# Altium schematic sheet 3V3_Smooth.SchDoc
size 193 x 146 mm; SheetNumber: 25; SheetTotal: 29
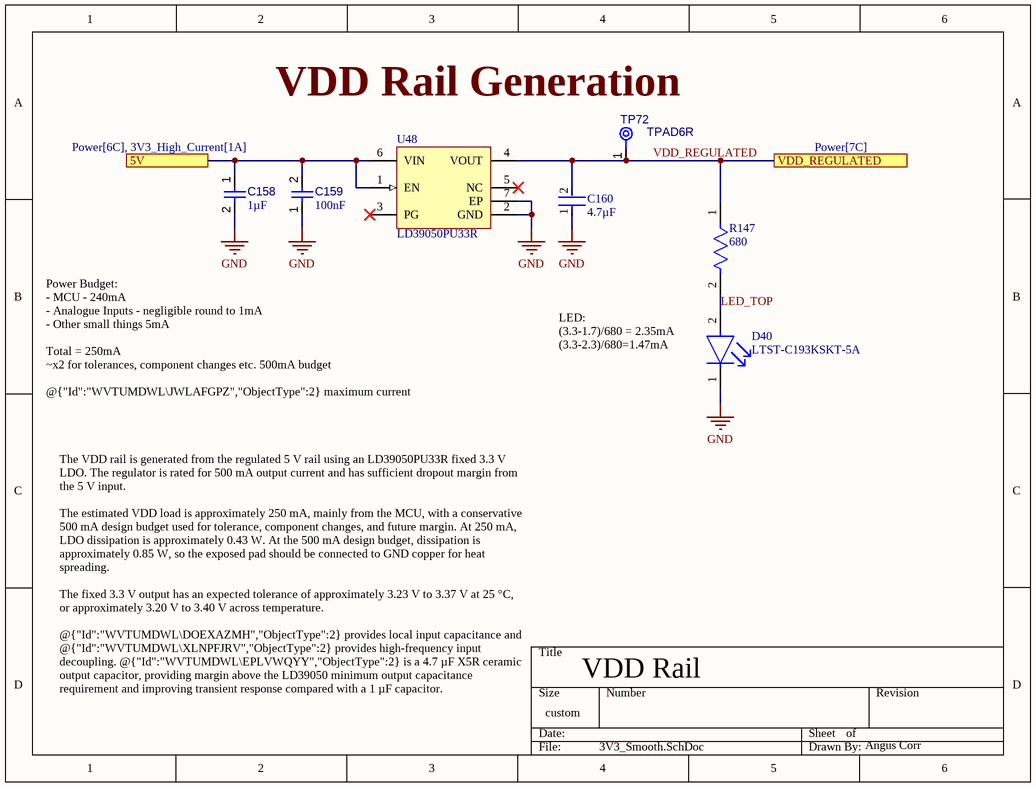
[diagram p0: 3V3_Smooth.SchDoc]

## Parts
C158  value 1µF  [CAPC1608X90X40LL10T20]  (hidden comment: Capacitor 1 uF +/- 10% 25 V 0603)
C159  value 100nF  [CAPC1608X90X40NL10T20]  (hidden comment: Capacitor 100 nF +/-10% 50 V 0603)
C160  value 4.7µF  [FP-GRM21B-0_2-e0_2_0_7-MFG]  (hidden comment: GRM21BZ71H475KE15L)
D40  LTST-C193KSKT-5A  [FP-LTST-C193KGKT-5A-MFG]
R147  value 680  [FP-CRCW0603-e3-IPC_C]  (hidden comment: CRCW0603680RJNEA)
TP72  TPAD6R  [TP06R]  (no BOM)
U48  LD39050PU33R  [DFN6D_L]

## Ports
5V (see Power[6C], 3V3_High_Current[1A]), VDD_REGULATED (see Power[7C])

## Nets
GND: C158.2 C159.1 C160.1 D40.1(C) U48.2(GND) U48.7(EP)
5V: C158.1 C159.2 U48.1(EN) U48.6(VIN) ; port 5V
LED_TOP: D40.2(A) R147.2
VDD_REGULATED: C160.2 R147.1 TP72.1(TP) U48.4(VOUT) ; port VDD_REGULATED

Not connected (* = marked no-connect by the designer): U48 3(PG)* 5(NC)*

## Notes on the sheet
- VDD Rail Generation
- Power Budget:
  - MCU - 240mA
  - Analogue Inputs - negligible round to 1mA
  - Other small things 5mA
  Total = 250mA
  ~x2 for tolerances, component changes etc. 500mA budget
  @{"Id":"WVTUMDWL\JWLAFGPZ","ObjectType":2} maximum current output of 500mA
- LED:
  (3.3-1.7)/680 = 2.35mA
  (3.3-2.3)/680=1.47mA
- The VDD rail is generated from the regulated 5 V rail using an LD39050PU33R fixed 3.3 V LDO. The regulator is rated for 500 mA output current and has sufficient dropout margin from the 5 V input.
  The estimated VDD load is approximately 250 mA, mainly from the MCU, with a conservative 500 mA design budget used for tolerance, component changes, and future margin. At 250 mA, LDO dissipation is approximately 0.43 W. At the 500 mA design budget, dissipation is approximately 0.85 W, so the exposed pad should be connected to GND copper for heat spreading.
  The fixed 3.3 V output has an expected tolerance of approximately 3.23 V to 3.37 V at 25 °C, or approximately 3.20 V to 3.40 V across temperature.
  @{"Id":"WVTUMDWL\DOEXAZMH","ObjectType":2} provides local input capacitance and @{"Id":"WVTUMDWL\XLNPFJRV","ObjectType":2} provides high-frequency input decoupling. @{"Id":"WVTUMDWL\EPLVWQYY","ObjectType":2} is a 4.7 µF X5R ceramic output capacitor, providing margin above the LD39050 minimum output capacitance requirement and improving transient response compared with a 1 µF capacitor.
  This rail is intended for internal VDD loads only, not as an external 3.3 V supply.
- VDD Rail
- Angus Corr

## Library data of the parts
C158 = CMP-001-00005-6: Chip Capacitor, 1 uF, +/- 10%, 25 V, 0603 (1608 Metric); Capacitor Type: Ceramic; Voltage Rating: 25V; Pins: 2; Mounting Technology: SM; RoHS Compliant: True; Max Operating Temperature: 125°C; Case/Package: 0603; Min Operating Temperature: -55°C; Tolerance: 10%
C159 = CMP-001-00017-6: Chip Capacitor, 100 nF, +/- 10%, 50 V, 0603 (1608 Metric); Voltage Rating: 50V; Capacitor Type: Ceramic; Tolerance: 10%; Mounting Technology: SM; Max Operating Temperature: 125°C; RoHS Compliant: True; Pins: 2; Case/Package: 0603; Min Operating Temperature: -55°C
C160 = CMP-001-00149-1: 50V 4.7uF X7R ±10% 0805 Multilayer Ceramic Capacitors MLCC - SMD/SMT ROHS; Manufacturer Lifecycle Status: IN PRODUCTION; Mounting Technology: Surface Mount; Case/Package: 0805; Min Operating Temperature: -55°C; Tolerance: 10%; Max Operating Temperature: 125°C; Voltage Rating: 50V; Country of Origin: Japan, Mainland China, Philippines, Singapore, Thailand; Dielectric Material: Ceramic; Export Control Classification Number (ECCN) Code: EAR99; Harmonized Tariff Schedule (HTS) Code: 8532.24.00.20; Height: 1.25mm; Introduction Date: 2017-02-22; Length: 2mm; Lifecycle Status: Production; Material: Ceramic; Number of Terminals: 2; REACH SVHC: Yes; RoHS: Compliant; Thickness: 1.25mm; Voltage Rating (DC): 50V; Width: 1.25mm
D40 = CMP-007-00044-1: LED yellow 0603 wavelength 587~594.5nm light intensity 7.1~45mcd Front Mounting; Shape: Rectangular; Power Dissipation: 50mW; Peak Wavelength: 591nm; Number of Circuits: 1; Lens Style: Colorless, Diffused, Rectangular; Test Current: 5mA; Forward Voltage: 2.3V; Lens Transparency: Clear; Lens Color: Clear, Colorless; Viewing Angle: 130°; Forward Current: 30mA; Reverse Voltage: 5V; Luminous Intensity: 26.05mcd; Schedule B: 8541402000, 8541402000; Introduction Date: 2007-04-09; Min Operating Temperature: -55°C; RoHS: Compliant; Terminal Pitch: 1.5mm; Case/Package: 0603; Width: 800µm; Dominant Wavelength: 594.5nm; Pins: 2; Case Code (Imperial): 0603; Height: 350µm; Length: 1.6mm; Color: Yellow; Lead Free: Lead Free; Max Operating Temperature: 85°C; Wavelength: 594.5nm; Harmonized Tariff Schedule (HTS) Code: 8541.40.20.00; China RoHS: Compliant; Illumination Color: Yellow; Number of Terminals: 2; Radiation Hardening: No; Case Code (Metric): 1608; Number of LEDs: 1; Depth: 800µm; Lifecycle Status: Production; REACH SVHC: Yes; Mounting Technology: Surface Mount; Number of Elements: 1
R147 = CMP-009-00300-1: Fixed Resistor, Metal Glaze/Thick Film, 0.1W, 680ohm, 75V, 5% +/-Tol, Surface Mount, 0603; Power Rating: 100mW; Temperature Coefficient: 200ppm/°C; Case/Package: 0603; Voltage Rating (DC): 75V; Lifecycle Status: Production; Depth: 850µm; Introduction Date: 2005-02-16; Number of Terminations: 2; Composition: Thick Film; Export Control Classification Number (ECCN) Code: EAR99; RoHS: Compliant; Packaging: Cut Tape; Max Power Dissipation: 100mW; Max Operating Temperature: 155°C; Harmonized Tariff Schedule (HTS) Code: 8533.21.00.30; Voltage Rating: 75V; China RoHS: Non-Compliant; Width: 850µm; Height: 450µm; Schedule B: 8533210045, 8533210045; Mounting Technology: Surface Mount; Pins: 2; Radiation Hardening: No; Features: Automotive AEC-Q200; Min Operating Temperature: -55°C; Lead Free: Lead Free; Working Voltage: 75V; Military Standard: Not; Tolerance: 5%; Case Code (Imperial): 0603; Number of Terminals: 2; Weight: 2.012816mg; REACH SVHC: Yes; Length: 1.55mm; Ratings: AEC-Q200; Contact Plating: Tin; Termination: SMD/SMT; Country of Origin: Israel, Taiwan
TP72 = CMP-00028-00002-2: 0.6mm round; Pins: 1
U48 = CMP-019-00056-1: 500 mA low quiescent current low noise voltage regulator; Max Supply Voltage: 5.5V; Output Current: 500mA; Output Voltage: 3.3V; Dropout Voltage: 400mV; Max Operating Temperature: 125°C; Case/Package: DFN EP; Pins: 6; Mounting Technology: Surface Mount; Min Operating Temperature: -40°C